# Altium schematic sheet Motion_Controller.schdoc: Magneto
size 420 x 297 mm; EDA_Number: ARTIQ; Projet: HVPSU_ISOL; Author: G.Kasprowicz; CompanyName: WUT ISE; DrawnBy: G.Kasprowicz; Organization: WUT ISE; Address1: PW ISE; Address2: Nowowiejska 15/19 00-665 Warsaw; Address3: gkasprow@gmail.com; DocumentNumber: 1; Revision: 2; SheetNumber: 1; SheetTotal: 7; ModifiedBy: -; CheckedDate: -; Title2: Top; DivGrp: WUT ISE; Designer: G.Kasprowicz; ModifiedDate: -; ProjectName: Sensor Box
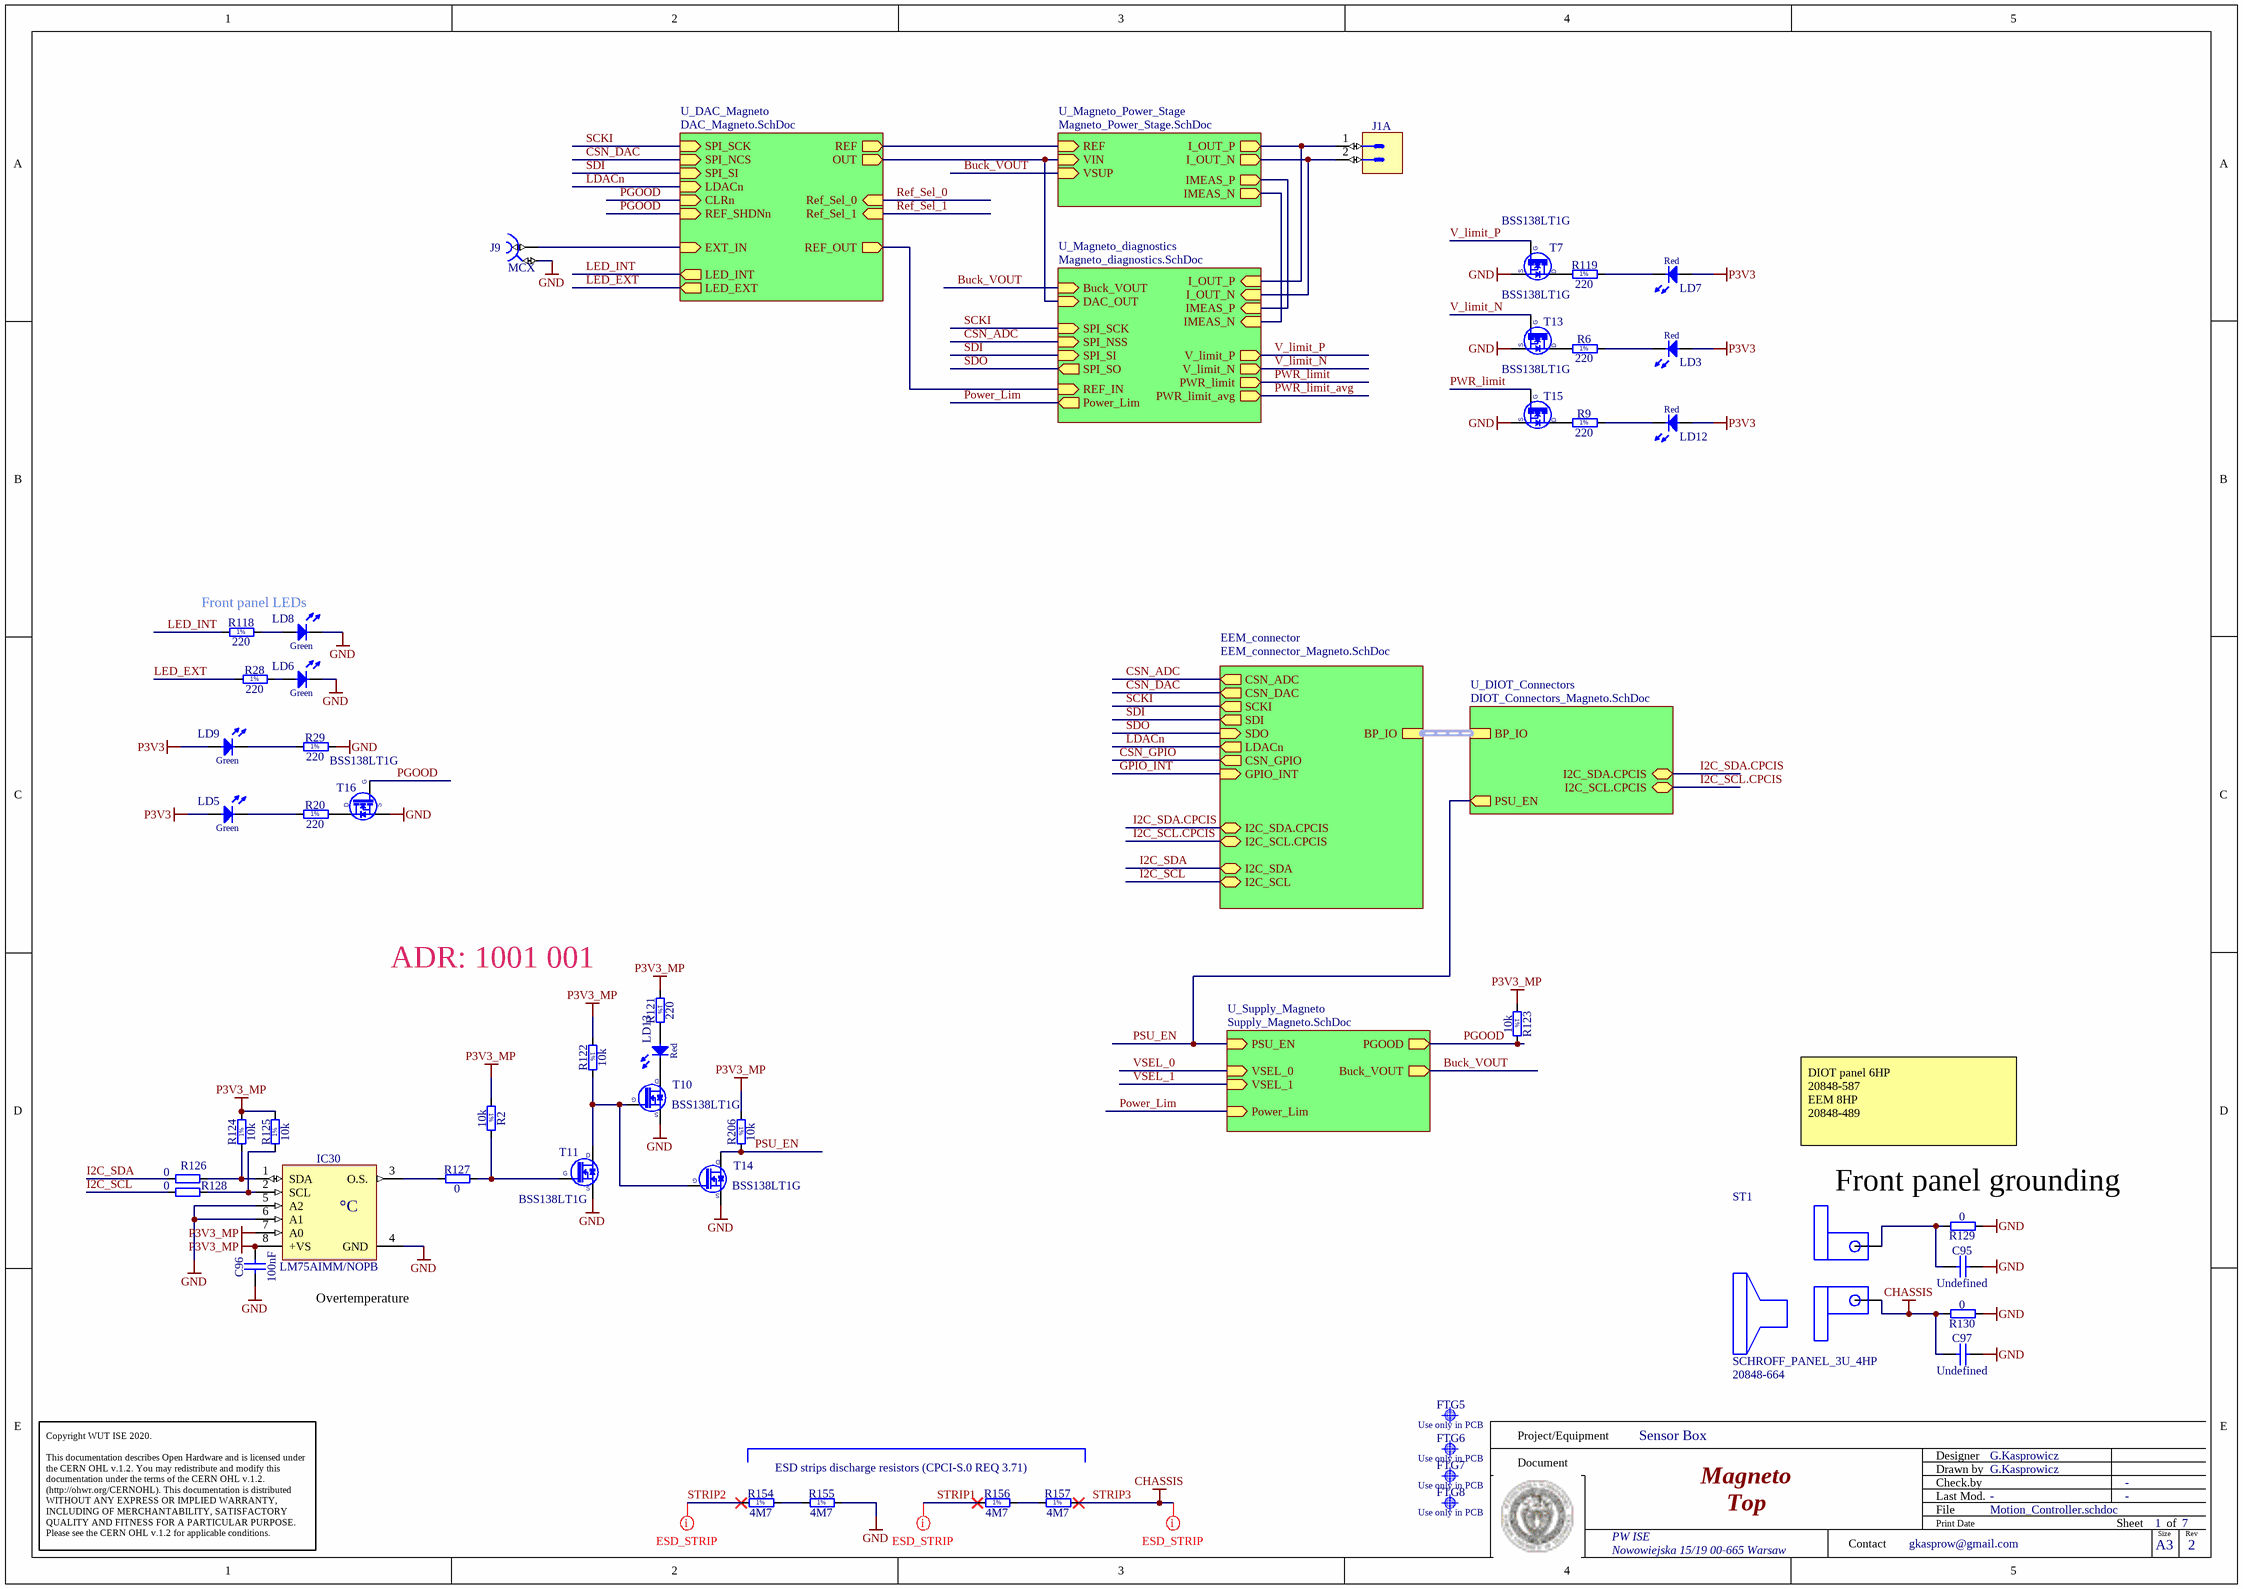
[diagram p0: Motion_Controller.schdoc]

## Parts
C95  Undefined  [CAPC2012X135N]
C96  100nF  [CAPC1005X55N]
C97  Undefined  [CAPC2012X135N]
FTG5  Use only in PCB  [FIDUCIAL_TOP_C100-200]  (no BOM)
FTG6  Use only in PCB  [FIDUCIAL_TOP_S100-200]  (no BOM)
FTG7  Use only in PCB  [FIDUCIAL_TOP_S100-200]  (no BOM)
FTG8  Use only in PCB  [FIDUCIAL_TOP_S100-200]  (no BOM)
IC30  LM75AIMM/NOPB  [SOP65P490X109-8N]
J1  (no value)  [PHOENIX_1817615]  (part A of 2)
J9  MCX  [AMPHENOL_919-383J-51A]
LD3  Red  [LED_DIALIGHT_555-200]
LD5  Green  [LED_DIALIGHT_555-230]
LD6  Green  [LED_DIALIGHT_555-230]
LD7  Red  [LED_DIALIGHT_555-200]
LD8  Green  [LED_DIALIGHT_555-230]
LD9  Green  [LED_DIALIGHT_555-230]
LD12  Red  [LED_DIALIGHT_555-200]
LD13  Red  [LED_DIALIGHT_555-200]
R2  10k  [RESC1005X40N]
R6  220  [RESC1608X55N]
R9  220  [RESC1608X55N]
R20  220  [RESC1608X55N]
R28  220  [RESC1608X55N]
R29  220  [RESC1608X55N]
R118  220  [RESC1608X55N]
R119  220  [RESC1608X55N]
R121  220  [RESC1608X55N]
R122  10k  [RESC1005X40N]
R123  10k  [RESC1005X40N]
R124  10k  [RESC1005X40N]
R125  10k  [RESC1005X40N]
R126  0  [RESC1005X40N]
R127  0  [RESC1005X40N]
R128  0  [RESC1005X40N]
R129  0  [RESC1608X55N]
R130  0  [RESC1608X55N]
R154  4M7  [RESC2113X55N]
R155  4M7  [RESC2113X55N]
R156  4M7  [RESC2113X55N]
R157  4M7  [RESC2113X55N]
R206  10k  [RESC1005X40N]
ST1  SCHROFF_PANEL_3U_4HP  Manufacturer Part Number 2: 20848-664  [SCHROFF_PANEL_3HP_4U]
T7  BSS138LT1G  [SOT95P240X110-3N]
T10  BSS138LT1G  [SOT95P240X110-3N]
T11  BSS138LT1G  [SOT95P240X110-3N]
T13  BSS138LT1G  [SOT95P240X110-3N]
T14  BSS138LT1G  [SOT95P240X110-3N]
T15  BSS138LT1G  [SOT95P240X110-3N]
T16  BSS138LT1G  [SOT95P240X110-3N]

## Sub-sheets
EEM_connector = EEM_connector_Magneto.SchDoc: BP_IO (harness BP_Conn), I2C_SDA.CPCIS (bidir), I2C_SCL.CPCIS (bidir), I2C_SDA (bidir), I2C_SCL (bidir), CSN_DAC (out), SCKI (out), SDI (out), LDACn (out), SDO (in), CSN_ADC (out), CSN_GPIO (out), GPIO_INT (in)
U_DAC_Magneto = DAC_Magneto.SchDoc: OUT (out), SPI_SCK (in), SPI_NCS (in), SPI_SI (in), CLRn (in), LDACn (in), REF_SHDNn (in), Ref_Sel_0 (in), Ref_Sel_1 (in), REF (out), EXT_IN (in), LED_INT (out), LED_EXT (out), REF_OUT (out)
U_DIOT_Connectors = DIOT_Connectors_Magneto.SchDoc: BP_IO (harness BP_Conn), I2C_SDA.CPCIS (bidir), I2C_SCL.CPCIS (bidir), PSU_EN (out)
U_Magneto_diagnostics = Magneto_diagnostics.SchDoc: Buck_VOUT (in), IMEAS_N (in), DAC_OUT (in), V_limit_P (out), V_limit_N (out), PWR_limit (out), SPI_SCK (in), SPI_NSS (in), SPI_SI (in), SPI_SO (out), I_OUT_P (in), I_OUT_N (in), IMEAS_P (in), REF_IN (in), Power_Lim (out), PWR_limit_avg (out)
U_Magneto_Power_Stage = Magneto_Power_Stage.SchDoc: REF (in), VIN (in), VSUP (in), I_OUT_P (out), I_OUT_N (out), IMEAS_P (out), IMEAS_N (out)
U_Supply_Magneto = Supply_Magneto.SchDoc: PSU_EN (in), PGOOD (out), VSEL_0 (in), VSEL_1 (in), Buck_VOUT (out), Power_Lim (in)

## Nets
GND: C95.2 C96.1 C97.2 IC30.4(GND) IC30.5(A2) IC30.6(A1) J9.2 LD6.1(C) LD8.1(C) R29.2 R129.1 R130.1 R155.2 T7.2(S) T10.2(S) T11.2(S) T13.2(S) T14.2(S) T15.2(S) T16.2(S)
P3V3: LD3.2(A) LD5.2(A) LD7.2(A) LD9.2(A) LD12.2(A)
P3V3_MP: C96.2 IC30.7(A0) IC30.8(+VS) R2.1 R121.1 R122.1 R123.1 R124.2 R125.2 R206.1
STRIP3: C97.1 R130.2 R157.2 ST1.0  [also labelled CHASSIS]
Buck_VOUT: sheet U_Magneto_Power_Stage/VSUP, sheet U_Supply_Magneto/Buck_VOUT, sheet U_Magneto_diagnostics/Buck_VOUT
CSN_ADC: sheet EEM_connector/CSN_ADC, sheet U_Magneto_diagnostics/SPI_NSS
CSN_DAC: sheet EEM_connector/CSN_DAC, sheet U_DAC_Magneto/SPI_NCS
CSN_GPIO: sheet EEM_connector/CSN_GPIO
GPIO_INT: sheet EEM_connector/GPIO_INT
I2C_SCL: R128.1 ; sheet EEM_connector/I2C_SCL
I2C_SCL.CPCIS: sheet EEM_connector/I2C_SCL.CPCIS, sheet U_DIOT_Connectors/I2C_SCL.CPCIS
I2C_SDA: R126.1 ; sheet EEM_connector/I2C_SDA
I2C_SDA.CPCIS: sheet EEM_connector/I2C_SDA.CPCIS, sheet U_DIOT_Connectors/I2C_SDA.CPCIS
LDACn: sheet EEM_connector/LDACn, sheet U_DAC_Magneto/LDACn
LED_EXT: R28.1 ; sheet U_DAC_Magneto/LED_EXT
LED_INT: R118.1 ; sheet U_DAC_Magneto/LED_INT
PGOOD: R123.2 T16.1(G) ; sheet U_DAC_Magneto/CLRn, sheet U_DAC_Magneto/REF_SHDNn, sheet U_Supply_Magneto/PGOOD
Power_Lim: sheet U_Supply_Magneto/Power_Lim, sheet U_Magneto_diagnostics/Power_Lim
PSU_EN: R206.2 T14.3(D) ; sheet U_DIOT_Connectors/PSU_EN, sheet U_Supply_Magneto/PSU_EN
PWR_limit: T15.1(G) ; sheet U_Magneto_diagnostics/PWR_limit
PWR_limit_avg: sheet U_Magneto_diagnostics/PWR_limit_avg
Ref_Sel_0: sheet U_DAC_Magneto/Ref_Sel_0
Ref_Sel_1: sheet U_DAC_Magneto/Ref_Sel_1
SCKI: sheet EEM_connector/SCKI, sheet U_DAC_Magneto/SPI_SCK, sheet U_Magneto_diagnostics/SPI_SCK
SDI: sheet EEM_connector/SDI, sheet U_DAC_Magneto/SPI_SI, sheet U_Magneto_diagnostics/SPI_SI
SDO: sheet EEM_connector/SDO, sheet U_Magneto_diagnostics/SPI_SO
STRIP1: R156.1
STRIP2: R154.1
V_limit_N: T13.1(G) ; sheet U_Magneto_diagnostics/V_limit_N
V_limit_P: T7.1(G) ; sheet U_Magneto_diagnostics/V_limit_P
VSEL_0: sheet U_Supply_Magneto/VSEL_0
VSEL_1: sheet U_Supply_Magneto/VSEL_1
NetC95_1: C95.1 R129.2 ST1.1
NetIC30_1: IC30.1(SDA) R124.1 R126.2
NetIC30_2: IC30.2(SCL) R125.1 R128.2
NetIC30_3: IC30.3(O.S.) R127.1
NetJ1_1: J1.1 ; sheet U_Magneto_Power_Stage/I_OUT_P, sheet U_Magneto_diagnostics/I_OUT_P
NetJ1_2: J1.2 ; sheet U_Magneto_Power_Stage/I_OUT_N, sheet U_Magneto_diagnostics/I_OUT_N
NetJ9_1: J9.1 ; sheet U_DAC_Magneto/EXT_IN
NetLD3_1: LD3.1(C) R6.1
NetLD5_1: LD5.1(C) R20.1
NetLD6_2: LD6.2(A) R28.2
NetLD7_1: LD7.1(C) R119.1
NetLD8_2: LD8.2(A) R118.2
NetLD9_1: LD9.1(C) R29.1
NetLD12_1: LD12.1(C) R9.1
NetLD13_1: LD13.1(C) T10.3(D)
NetLD13_2: LD13.2(A) R121.2
NetR2_2: R2.2 R127.2 T11.1(G)
NetR6_2: R6.2 T13.3(D)
NetR9_2: R9.2 T15.3(D)
NetR20_2: R20.2 T16.3(D)
NetR119_2: R119.2 T7.3(D)
NetR122_2: R122.2 T10.1(G) T11.3(D) T14.1(G)
NetR154_2: R154.2 R155.1
NetR156_2: R156.2 R157.1
(unnamed): sheet U_DAC_Magneto/OUT, sheet U_Magneto_Power_Stage/VIN, sheet U_Magneto_diagnostics/DAC_OUT
(unnamed): sheet U_DAC_Magneto/REF, sheet U_Magneto_Power_Stage/REF
(unnamed): sheet U_DAC_Magneto/REF_OUT, sheet U_Magneto_diagnostics/REF_IN
(unnamed): sheet U_Magneto_Power_Stage/IMEAS_P, sheet U_Magneto_diagnostics/IMEAS_P
(unnamed): sheet U_Magneto_Power_Stage/IMEAS_N, sheet U_Magneto_diagnostics/IMEAS_N

## Buses and harness runs
harness sheet EEM_connector/BP_IO = sheet U_DIOT_Connectors/BP_IO

## Layout directives
net class ESD_STRIP: STRIP1, STRIP2, STRIP3

## Notes on the sheet
- Front panel LEDs
- ADR: 1001 001
- DIOT panel 6HP
  20848-587
  EEM 8HP
  20848-489
- (near R129) Front panel grounding
- Overtemperature
- ESD strips discharge resistors (CPCI-S.0 REQ 3.71)
- Project/Equipment
- Document
- Designer
- Drawn by
- Check.by
- Copyright WUT ISE 2020.
  This documentation describes Open Hardware and is licensed under the CERN OHL v.1.2. You may redistribute and modify this documentation under the terms of the CERN OHL v.1.2. (http://ohwr.org/CERNOHL). This documentation is distributed WITHOUT ANY EXPRESS OR IMPLIED WARRANTY, INCLUDING OF MERCHANTABILITY, SATISFACTORY QUALITY AND FITNESS FOR A PARTICULAR PURPOSE. Please see the CERN OHL v.1.2 for applicable conditions.
- Contact
- File
- Last Mod.
- Print Date
- Sheet
- Size
- A3
- of
- Rev
- (in symbol LM75AIMM/NOPB) °C
- (in symbol R0402_10K_1%_0.0625W_100PPM) 1%
- (in symbol R0603_220R_1%_0.1W_100PPM) 1%
- (in symbol R0805_4M7_1%_0.125W_100PPM_VISHAY_CRCW e3) 1%

## Library data of the parts
C95 C97 = CC0805_NO-VALUE: Non-polarised capacitor; Part Description: Reserved Footprint For 0805(2012) Chip Ceramic Capacitor; Mounted: No; Part Number: CC0805_NO-VALUE; Component Kind: Standard; Component Type: Standard; Pin Count: 2; Value: Undefined; Status: None; Manufacturer: Undefined; Manufacturer Part Number: CC0805_NO-VALUE; Case: 0805; Socket: No; SMD: Yes; Sense: No; Manufacturer1 ComponentHeight: 1.35mm; HelpURL: Undefined; Author: CERN DEM JLC; CreateDate: 10.12.2008; LatestRevisionDate: 11.09.2013
C96 = CC0402_100NF_16V_10%_X5R: Non-polarised capacitor; Part Description: SMD Multilayer Chip Ceramic Capacitor; Manufacturer: GENERIC; Manufacturer1 Part Number: GRM155R61C104KA88D; Voltage: 16V; TC: X5R; Tolerance: ±10%; Part Number: CC0402_100NF_16V_10%_X5R; Component Kind: Standard; Component Type: Standard; Pin Count: 2; Value: 100nF; Status: None; Manufacturer Part Number: CC0402_100NF_16V_10%_X5R; Case: 0402; Mounted: Yes; Socket: No; SMD: Yes; Sense: No; Manufacturer1 Example: MURATA; Manufacturer1 ComponentHeight: 0.55mm; HelpURL: \\cern.ch\dfs\Applications\Altium\Datasheets\CC0402_X5R_MURATA_GRM.pdf; Author: CERN DEM JLC; CreateDate: 10.12.2013; LatestRevisionDate: 10.12.2013
FTG5 = FIDUCIAL_TARGET_C100-200: Fiducial Target; Part Description: Round Fiducial Target, Top Layer, 1.0mm, Top Solder 2.0mm, Keepout =2.0mm; Mounted: No; Part Number: FIDUCIAL_TARGET_C100-200; Component Type: Standard (No BOM); Pin Count: 1; Family: Fiducial; Socket: No; SMD: Yes; Sense: No; Status: None; ComponentHeight: 0mm; HelpURL: Undefined; Author: CERN DEM JLC; CreateDate: 09.02.2010; LatestRevisionDate: 04.04.2012; PackageDescription: Round Fiducial Target, Top Layer, 1.0mm, Top Solder 2.0mm, Keepout =2.0mm
FTG6-FTG8 = FIDUCIAL_TARGET_S100-200: Fiducial Target; Part Description: Square Fiducial Target, Top Layer, 1.0mm, Top Solder 2.0mm, Keepout =2.0mm; Mounted: No; Part Number: FIDUCIAL_TARGET_S100-200; Component Type: Standard (No BOM); Pin Count: 1; Family: Fiducial; Socket: No; SMD: Yes; Sense: No; Status: None; ComponentHeight: 0mm; HelpURL: Undefined; Author: CERN DEM JLC; CreateDate: 09.02.2010; LatestRevisionDate: 04.04.2012; PackageDescription: Square Fiducial Target, Top Layer, 1.0mm, Top Solder 2.0mm, Keepout =2.0mm
IC30 = LM75AIMM/NOPB: Digital Temperature Sensor and Thermal Watchdog with Two-Wire Interface; Part Description: -25° to +100°C ±2°C Digital Temperature Sensor and Thermal Watchdog with Two-Wire Interface; Manufacturer: TEXAS INSTRUMENTS; PressFit: No; Bonding: No; Part Number: LM75AIMM/NOPB; Component Kind: Standard; Component Type: Standard; Device: LM75AIMM/NOPB; PackageDescription: SOP, 0.65mm pitch; 8 pin,3.00mm W X 3.00mm L X 1.09mm H bodyI, PC Medium Density; Manufacturer Part Number: LM75AIMM/NOPB; Pin Count: 8; Case: SSOP8; Mounted: Yes; Socket: No; SMD: Yes; Sense: No; ComponentHeight: 1.09mm; HelpURL: \\cern.ch\dfs\Applications\Altium\Datasheets\LM75AIMM-NOPB.pdf; Author: CERN DEM JLC; CreateDate: 15.10.2012; LatestRevisionDate: 15.10.2012
J1 = PHOENIX_1817615: Connector 2 Male+2MTG; Part Description: 8A 160V, 2 Position PCB Terminal Block, Pitch 3.5mm, Lock & Release Threaded Flange (Conductor/PCB connection direction: 90°); Manufacturer: PHOENIX CONTACT; Manufacturer Part Number: 1817615 (MC 1,5/ 2-GF-3,5-LR); PressFit: No; Part Number: PHOENIX_1817615; Component Kind: Standard; Component Type: Standard; Pin Count: 2; Mounted: Yes; Socket: No; SMD: No; Sense: No; Status: None; ComponentHeight: 7.25mm; HelpURL: \\cern.ch\dfs\Applications\Altium\Datasheets\PHOENIX_1817615.pdf; Author: CERN DEM BC; CreateDate: 04.06.2021; LatestRevisionDate: 04.06.2021
J9 = AMPHENOL_919-383J-51A: Part Description: 50 Ohm, RF Connector, MCX Right Angle PCB Receptacle Jack; PressFit: No; Part Number: AMPHENOL_919-383J-51A; Component Kind: Standard; Component Type: Standard; Pin Count: 5; Family: MCX; Mounted: Yes; Socket: No; SMD: No; Sense: No; Status: None; Manufacturer: AMPHENOL; Manufacturer Part Number: 919-383J-51A; ComponentHeight: 6mm; HelpURL: \\cern.ch\dfs\Applications\Altium\Datasheets\AMPHENOL_919-383J-51A.pdf; Author: CERN DEM BC; CreateDate: 31.01.2019; LatestRevisionDate: 31.01.2019
LD3 LD7 LD12 LD13 = LED_DIALIGHT_555-2001F: LED Red 1C 2A; Part Description: Single 2mm Red LED CBI® Circuit Board Indicator; PressFit: No; Bonding: No; Part Number: LED_DIALIGHT_555-2001F; Component Kind: Standard; Component Type: Standard; Color: Red; PackageDescription: Single 2mm Red LED, Body 5.08x2.54mm, Pin spacing 2.54mm; Manufacturer: DIALIGHT; Manufacturer Part Number: 555-2001F; Pin Count: 2; Mounted: Yes; Socket: No; SMD: No; Sense: No; ComponentHeight: 6.35mm; HelpURL: \\cern.ch\dfs\Applications\Altium\Datasheets\LED_DIALIGHT_555-2001F.pdf; Author: CERN DEM JMW; CreateDate: 22.09.2008; LatestRevisionDate: 17.03.2010
LD5 LD6 LD8 LD9 = LED_DIALIGHT_555-2301F: LED Green 1C 2A; Part Description: Single 2mm Green LED CBI® Circuit Board Indicator; PressFit: No; Bonding: No; Part Number: LED_DIALIGHT_555-2301F; Component Kind: Standard; Component Type: Standard; Color: Green; PackageDescription: Single 2mm Green LED, Body 5.08x2.54mm, Pin spacing 2.54mm; Manufacturer: DIALIGHT; Manufacturer Part Number: 555-2301F; Pin Count: 2; Mounted: Yes; Socket: No; SMD: No; Sense: No; ComponentHeight: 6.35mm; HelpURL: \\cern.ch\dfs\Applications\Altium\Datasheets\LED_DIALIGHT_555-2301F.pdf; Author: CERN DEM JMW; CreateDate: 22.09.2008; LatestRevisionDate: 17.03.2010
R2 R122-R125 R206 = R0402_10K_1%_0.0625W_100PPM: Resistor - 1%; Part Description: General Purpose Thick Film Chip Resistor; Manufacturer: GENERIC; Manufacturer1 Part Number: 232270671003L; TC: ±100ppm/°C; PressFit: No; Part Number: R0402_10K_1%_0.0625W_100PPM; Component Kind: Standard; Component Type: Standard; Pin Count: 2; Value: 10k; Status: Not Recommended; Power: 0.0625W; Tolerance: ±1%; Manufacturer Part Number: R0402_10K_1%_0.0625W_100PPM; Case: 0402; Mounted: Yes; Sense: No; Socket: No; SMD: Yes; Manufacturer1 Example: YAGEO PHYCOMP; Manufacturer1 ComponentHeight: 0.4mm; HelpURL: \\cern.ch\dfs\Applications\Altium\Datasheets\R0402_Phycomp_RC0402.pdf; Author: CERN DEM JLC; CreateDate: 03.12.2007; LatestRevisionDate: 17.10.2012
R6 R9 R20 R28 R29 R118 R119 R121 = R0603_220R_1%_0.1W_100PPM: Resistor - 1%; Part Description: General Purpose Thick Film Chip Resistor; Manufacturer: GENERIC; Manufacturer1 Part Number: NRC06F2200TRF; Power: 0.1W; TC: ±100ppm/°C; Part Number: R0603_220R_1%_0.1W_100PPM; Component Kind: Standard; Component Type: Standard; Pin Count: 2; Value: 220; Status: Preferred; Tolerance: ±1%; Manufacturer Part Number: R0603_220R_1%_0.1W_100PPM; Case: 0603; Mounted: Yes; Sense: No; Socket: No; SMD: Yes; Manufacturer1 Example: NIC COMPONENT; Manufacturer1 ComponentHeight: 0.55mm; HelpURL: \\cern.ch\dfs\Applications\Altium\Datasheets\R0603_NIC_NRC.pdf; Author: CERN DEM JLC; CreateDate: 03.12.2007; LatestRevisionDate: 13.03.2008
R126-R128 = R0402_0R_JUMPER: Resistor; Part Description: 1A (0.05R Max DC Resistance) Zero Ohm Jumper; Manufacturer: GENERIC; Manufacturer1 Part Number: 232270591001L; Part Number: R0402_0R_JUMPER; Component Kind: Standard; Component Type: Standard; Pin Count: 2; Value: 0; Status: Not recommended; Manufacturer Part Number: R0402_0R_JUMPER; Case: 0402; Mounted: Yes; Sense: No; Socket: No; SMD: Yes; Manufacturer1 Example: YAGEO PHYCOMP; Manufacturer1 ComponentHeight: 0.4mm; HelpURL: \\cern.ch\dfs\Applications\Altium\Datasheets\R0402_Phycomp_RC0402.pdf; Author: CERN DEM JLC; CreateDate: 03.12.2007; LatestRevisionDate: 17.10.2012
R129 R130 = R0603_0R_JUMPER: Resistor; Part Description: 1A (0.05R Max DC Resistance) Zero Ohm Jumper; Manufacturer: GENERIC; Manufacturer1 Part Number: NRC06Z0; PressFit: No; Part Number: R0603_0R_JUMPER; Component Kind: Standard; Component Type: Standard; Pin Count: 2; Value: 0; Status: Preferred; Manufacturer Part Number: R0603_0R_JUMPER; Case: 0603; Mounted: Yes; Sense: No; Socket: No; SMD: Yes; Manufacturer1 Example: NIC COMPONENT; Manufacturer1 ComponentHeight: 0.55mm; HelpURL: \\cern.ch\dfs\Applications\Altium\Datasheets\R0603_NIC_NRC.pdf; Author: CERN DEM JLC; CreateDate: 03.12.2007; LatestRevisionDate: 13.03.2008
R154-R157 = R0805_4M7_1%_0.125W_100PPM_VISHAY_CRCW e3: Resistor - 1%; Part Description: 150V, Standard Thick Film Chip Resistor; Manufacturer: VISHAY; Manufacturer Part Number: CRCW08054M70FKEA; Power: 0.125W; TC: ±100ppm/°C; PressFit: No; Part Number: R0805_4M7_1%_0.125W_100PPM_VISHAY_CRCW e3; Component Kind: Standard; Component Type: Standard; Pin Count: 2; Value: 4M7; Status: None; Tolerance: ±1%; Case: 0805; Mounted: Yes; Sense: No; Socket: No; SMD: Yes; ComponentHeight: 0.5mm; HelpURL: \\cern.ch\dfs\Applications\Altium\Datasheets\R0805_VISHAY_CRCW e3.pdf; Author: CERN DEM BR; CreateDate: 27/05/2019; LatestRevisionDate: 27/05/2019
ST1 = SCHROFF_PANEL_3U_4HP: Schroff 3HP 4U EUROCARD Panel Kit; Manufacturer Part Number: 20818-017; Manufacturer: Schroff
T7 T10 T11 T13-T16 = BSS138LT1G: N-CHANNEL MOSFET WITH DIODE; Part Description: 50V 200mA N-Channel Enhancement Mode Field-Effect Transistor; Manufacturer: ON SEMICONDUCTOR; PressFit: No; Bonding: No; Part Number: BSS138LT1G; Component Kind: Standard; Component Type: Standard; Device: BSS138LT1G; PackageDescription: SOT23 3-Leads, Pitch 0.95mm - Body 1.4x3mm, IPC Medium Density; Manufacturer Part Number: BSS138LT1G; Pin Count: 3; Case: SOT23-3; Mounted: Yes; Socket: No; SMD: Yes; Sense: No; ComponentHeight: 1.11mm; HelpURL: \\cern.ch\dfs\Applications\Altium\Datasheets\BSS138LT1G.pdf; Author: CERN DEM JLC; CreateDate: 23.03.2009; LatestRevisionDate: 23.03.2009